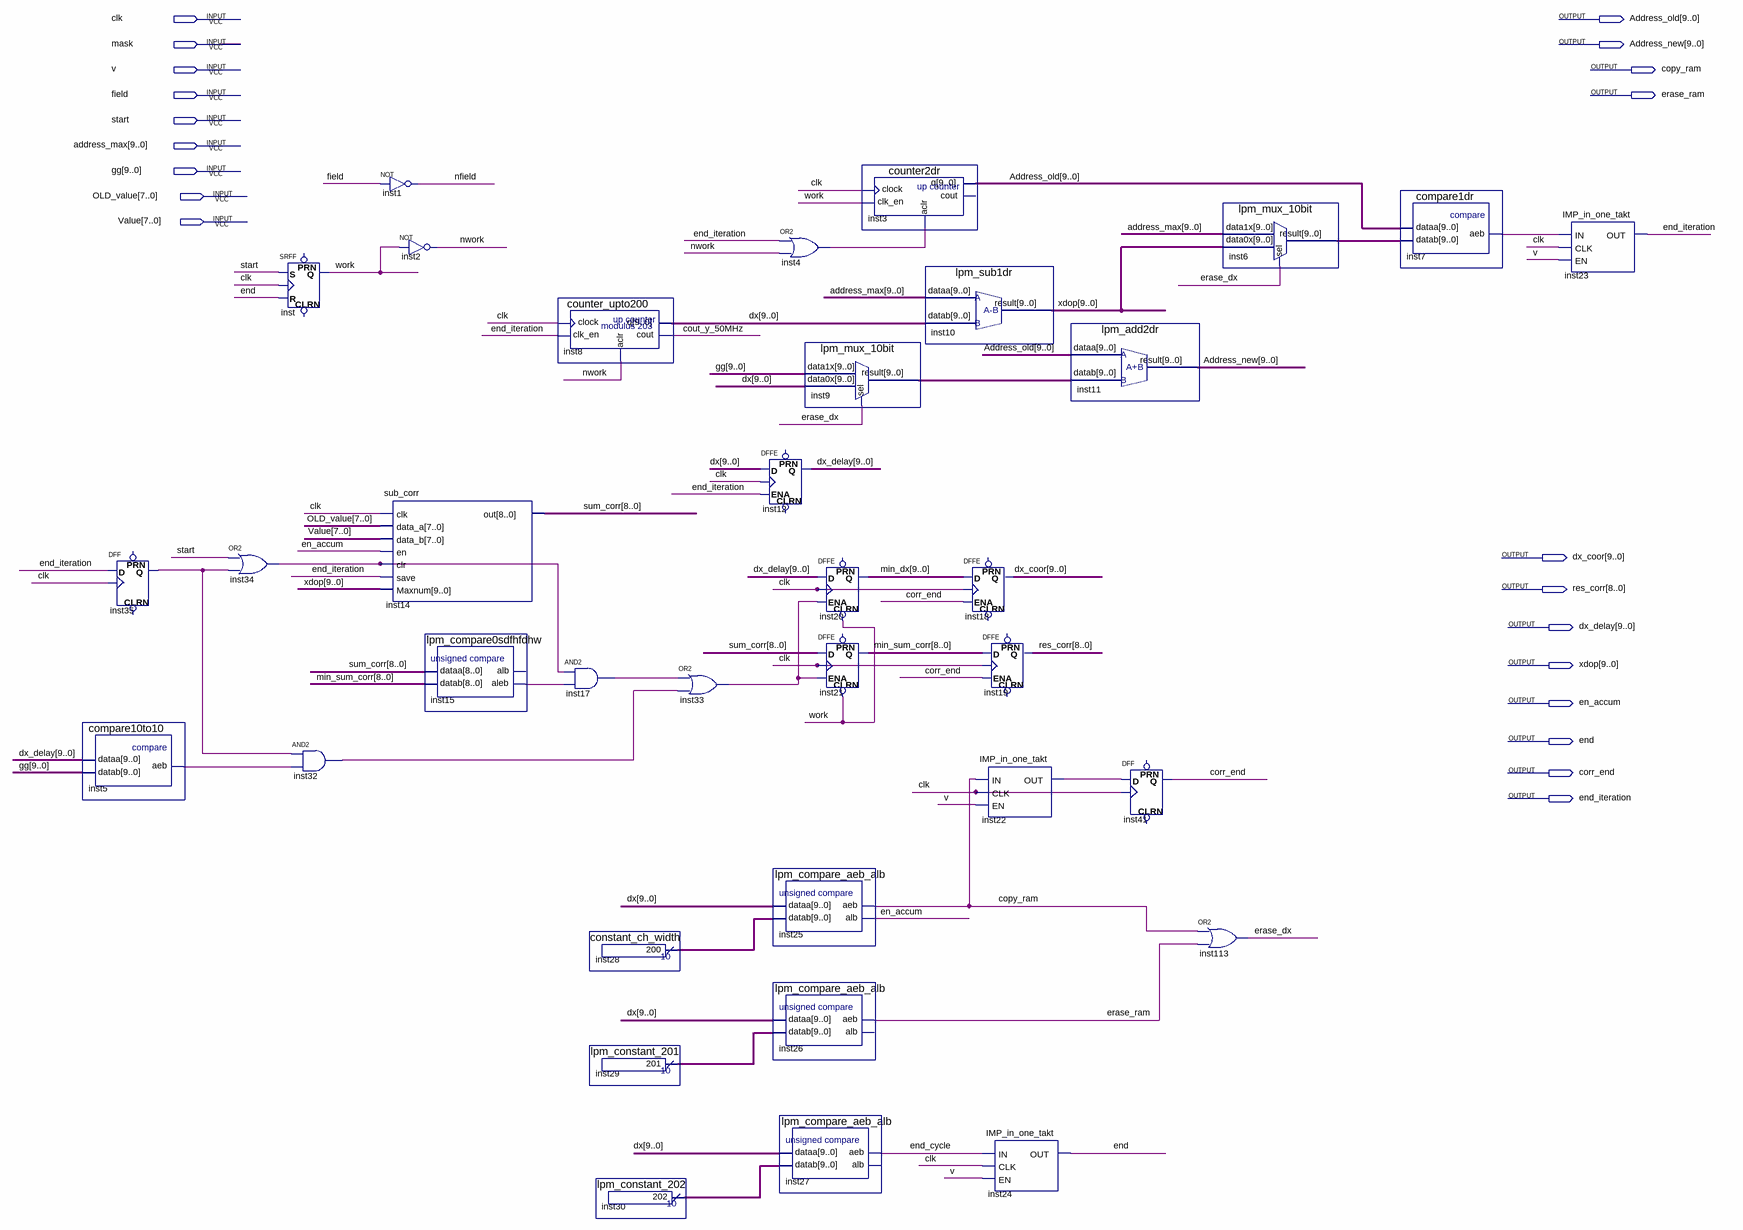
[diagram p0: schematic sheet]
// Quartus schematic Control_RAM.bdf as structural Verilog: 35 symbols, 21 pins
module Control_RAM (
  input  clk,
  input  mask,
  input  v,
  input  field,
  input  start,
  input  [9:0] address_max,
  input  [9:0] gg,
  input  [7:0] OLD_value,
  input  [7:0] Value,
  output [9:0] Address_old,
  output [9:0] Address_new,
  output copy_ram,
  output erase_ram,
  output [9:0] dx_coor,
  output [8:0] res_corr,
  output [9:0] dx_delay,
  output [9:0] xdop,
  output en_accum,
  output \end ,
  output corr_end,
  output end_iteration
);

  wire cout_y_50MHz, end_cycle, erase_dx, inst4_out, inst5_aeb, inst7_aeb, inst15_aleb, inst17_out,
       inst22_out, inst32_out, inst33_out, inst34_out, inst35_q, nfield, nwork, work;
  wire [8:0] min_sum_corr, sum_corr;
  wire [9:0] dx, inst6_result, inst9_result, inst28_result, inst29_result, inst30_result, min_dx;

  DFF inst35 (.CLK(clk), .D(end_iteration), .Q(inst35_q));  // open: CLRN, PRN
  compare10to10 inst5 (.dataa(dx_delay), .datab(gg), .aeb(inst5_aeb));
  or inst34 (inst34_out, start, inst35_q);
  SRFF inst (.S(start), .R(\end ), .CLK(clk), .Q(work));  // open: PRN, CLRN
  and inst32 (inst32_out, inst35_q, inst5_aeb);
  not inst1 (nfield, field);
  not inst2 (nwork, work);
  sub_corr inst14 (
    .clk(clk), .data_a(OLD_value), .data_b(Value), .en(en_accum), .clr(inst34_out), .save(end_iteration),
    .Maxnum(xdop), .out(sum_corr));
  lpm_compare0sdfhfdhw inst15 (.dataa(sum_corr), .datab(min_sum_corr), .aleb(inst15_aleb));  // open: alb
  counter_upto200 inst8 (.clock(clk), .clk_en(end_iteration), .aclr(nwork), .cout(cout_y_50MHz), .q(dx));
  and inst17 (inst17_out, inst34_out, inst15_aleb);
  constant_ch_width inst28 (.result(inst28_result));
  lpm_constant_201 inst29 (.result(inst29_result));
  lpm_constant_202 inst30 (.result(inst30_result));
  or inst33 (inst33_out, inst17_out, inst32_out);
  DFFE inst12[9:0] (.D(dx), .CLK(clk), .ENA(end_iteration), .Q(dx_delay));  // open: PRN, CLRN
  or inst4 (inst4_out, end_iteration, nwork);
  lpm_mux_10bit inst9 (.data1x(gg), .data0x(dx), .sel(erase_dx), .result(inst9_result));
  DFFE inst20[9:0] (.CLRN(work), .D(dx_delay), .CLK(clk), .ENA(inst33_out), .Q(min_dx));  // open: PRN
  DFFE inst21[8:0] (.CLRN(work), .D(sum_corr), .CLK(clk), .ENA(inst33_out), .Q(min_sum_corr));  // open: PRN
  lpm_compare_aeb_alb inst25 (.dataa(dx), .datab(inst28_result), .aeb(copy_ram), .alb(en_accum));
  lpm_compare_aeb_alb inst26 (.dataa(dx), .datab(inst29_result), .aeb(erase_ram));  // open: alb
  lpm_compare_aeb_alb inst27 (.dataa(dx), .datab(inst30_result), .aeb(end_cycle));  // open: alb
  counter2dr inst3 (.clock(clk), .clk_en(work), .aclr(inst4_out), .q(Address_old));  // open: cout
  lpm_sub1dr inst10 (.dataa(address_max), .datab(dx), .result(xdop));
  DFFE inst18[9:0] (.D(min_dx), .CLK(clk), .ENA(corr_end), .Q(dx_coor));  // open: PRN, CLRN
  DFFE inst19[8:0] (.D(min_sum_corr), .CLK(clk), .ENA(corr_end), .Q(res_corr));  // open: PRN, CLRN
  IMP_in_one_takt inst22 (.IN(copy_ram), .CLK(clk), .EN(v), .OUT(inst22_out));
  IMP_in_one_takt inst24 (.IN(end_cycle), .CLK(clk), .EN(v), .OUT(\end ));
  lpm_add2dr inst11 (.dataa(Address_old), .datab(inst9_result), .result(Address_new));
  DFF inst41 (.CLK(clk), .D(inst22_out), .Q(corr_end));  // open: CLRN, PRN
  lpm_mux_10bit inst6 (.data1x(address_max), .data0x(xdop), .sel(erase_dx), .result(inst6_result));
  or inst113 (erase_dx, copy_ram, erase_ram);
  compare1dr inst7 (.dataa(Address_old), .datab(inst6_result), .aeb(inst7_aeb));
  IMP_in_one_takt inst23 (.IN(inst7_aeb), .CLK(clk), .EN(v), .OUT(end_iteration));
endmodule
